# Altium schematic sheet MotorDriver.SchDoc: MotorDriver.SchDoc
size A4; CheckedBy: fx; Author: flotox@yeah.net; Revision: v1.0.0; SheetNumber: 9; SheetTotal: 10
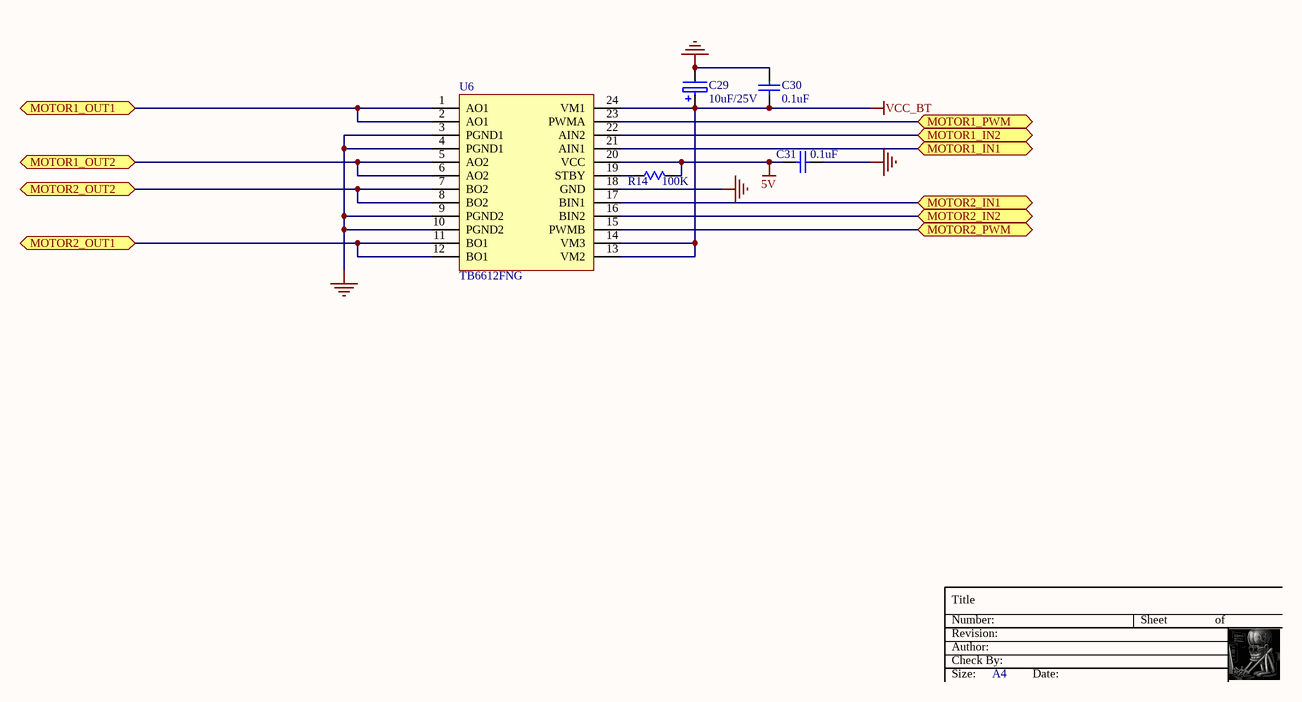
[diagram p0: MotorDriver.SchDoc]

## Parts
C29  10uF/25V  [TC3528-1411]
C30  0.1uF  [C0603-S]
C31  0.1uF  [C0603-S]
R14  100K  [R0603-S]
U6  TB6612FNG  [SSOP24-300-0.65A]

## Ports
MOTOR1_IN1, MOTOR1_IN2, MOTOR1_OUT1, MOTOR1_OUT2, MOTOR1_PWM, MOTOR2_IN1, MOTOR2_IN2, MOTOR2_OUT1, MOTOR2_OUT2, MOTOR2_PWM

## Nets
5V: C31.2 R14.1 U6.20(VCC)
GND: C29.2 C30.2 C31.1 U6.3(PGND1) U6.4(PGND1) U6.9(PGND2) U6.10(PGND2) U6.18(GND)
VCC_BT: C29.1 C30.1 U6.13(VM2) U6.14(VM3) U6.24(VM1)
MOTOR1_IN1: U6.21(AIN1) ; port MOTOR1_IN1
MOTOR1_IN2: U6.22(AIN2) ; port MOTOR1_IN2
MOTOR1_OUT1: U6.1(AO1) U6.2(AO1) ; port MOTOR1_OUT1
MOTOR1_OUT2: U6.5(AO2) U6.6(AO2) ; port MOTOR1_OUT2
MOTOR1_PWM: U6.23(PWMA) ; port MOTOR1_PWM
MOTOR2_IN1: U6.17(BIN1) ; port MOTOR2_IN1
MOTOR2_IN2: U6.16(BIN2) ; port MOTOR2_IN2
MOTOR2_OUT1: U6.11(BO1) U6.12(BO1) ; port MOTOR2_OUT1
MOTOR2_OUT2: U6.7(BO2) U6.8(BO2) ; port MOTOR2_OUT2
MOTOR2_PWM: U6.15(PWMB) ; port MOTOR2_PWM
NetR14_2: R14.2 U6.19(STBY)

## Notes on the sheet
- Title
- Revision:
- Number:
- Author:
- Check By:
- Sheet
- of
- Size:
- A4
- Date:

## Library data of the parts
C29 = CAP-ELEC: Polarized Capacitor
C30 C31 = CAP: Capacitor
R14 = RES: Resistor
U6 = TB6612FNG: Driver IC for Dual DC motor